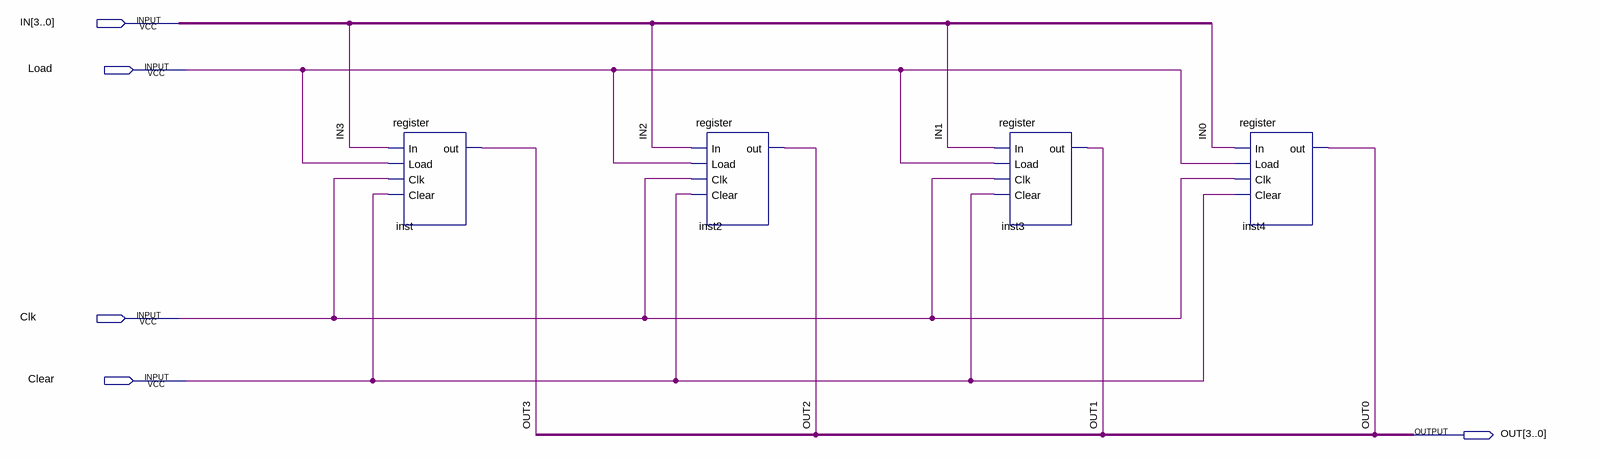
[diagram p0: schematic sheet]
// Quartus schematic registerrr.bdf as structural Verilog: 4 symbols, 5 pins
module registerrr (
  input  [3:0] IN,
  input  Load,
  input  Clk,
  input  Clear,
  output [3:0] OUT
);

  register inst (.In(IN[3]), .Load(Load), .Clk(Clk), .Clear(Clear), .out(OUT[3]));
  register inst2 (.In(IN[2]), .Load(Load), .Clk(Clk), .Clear(Clear), .out(OUT[2]));
  register inst3 (.In(IN[1]), .Load(Load), .Clk(Clk), .Clear(Clear), .out(OUT[1]));
  register inst4 (.In(IN[0]), .Load(Load), .Clk(Clk), .Clear(Clear), .out(OUT[0]));
endmodule
